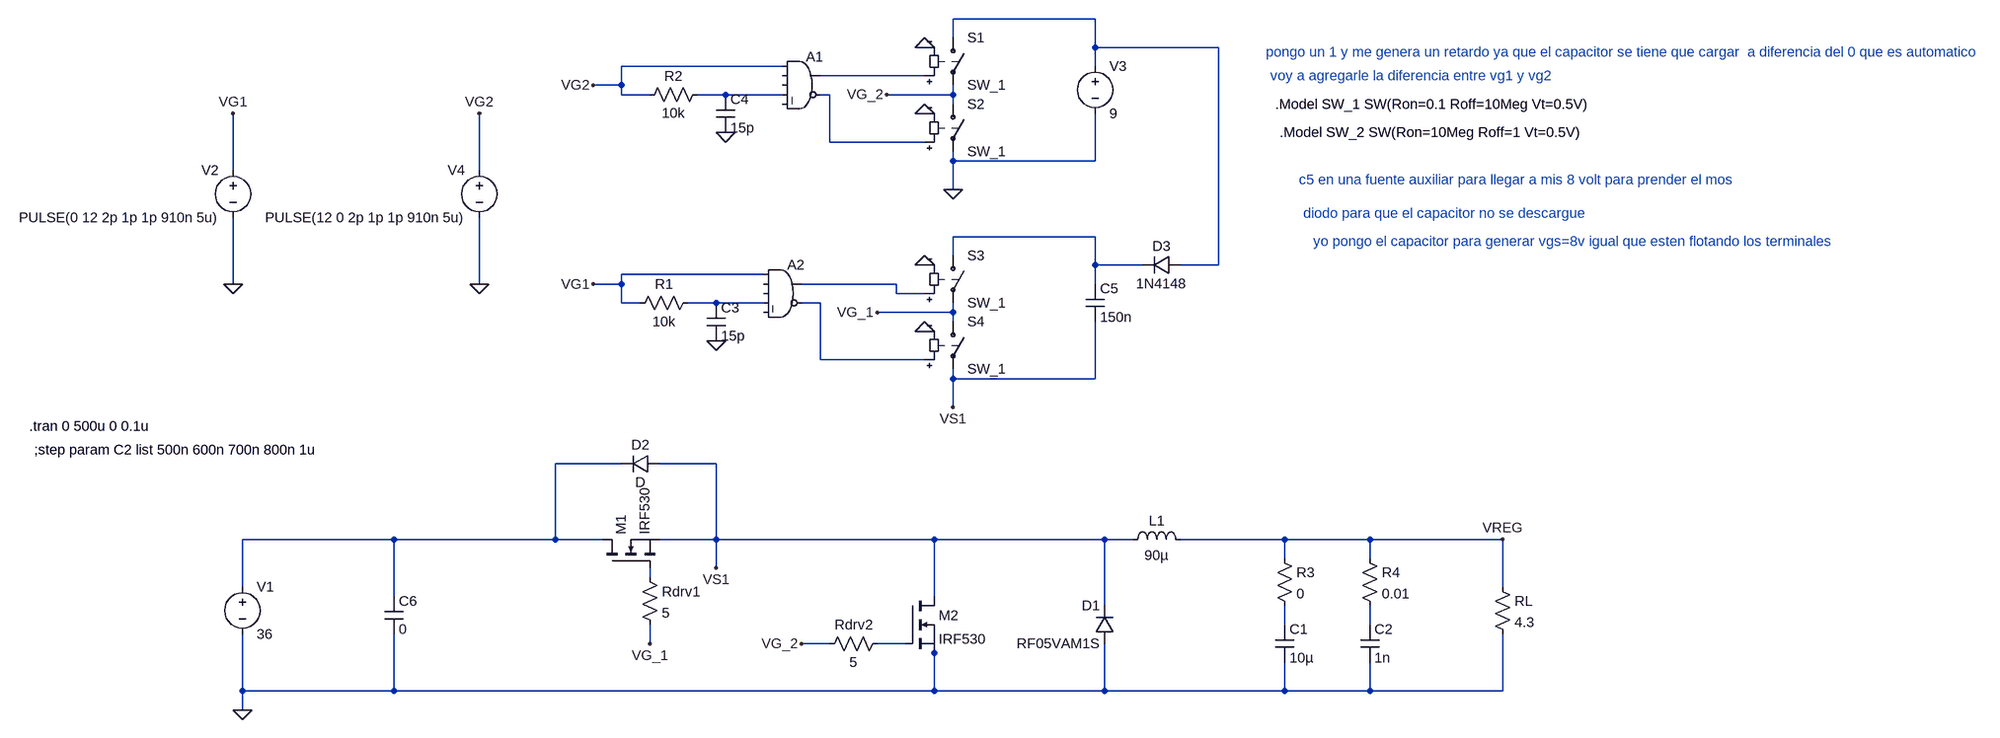
[diagram p0: schematic BUCK_v3.asc]
BUCK_v3.asc, the LTspice schematic file:
Version 4
SHEET 1 1932 728
WIRE -400 -784 -640 -784
WIRE -640 -752 -640 -784
WIRE -400 -736 -400 -784
WIRE -192 -736 -400 -736
WIRE -928 -704 -1200 -704
WIRE -400 -704 -400 -736
WIRE -688 -688 -864 -688
WIRE -1200 -672 -1200 -704
WIRE -1200 -672 -1248 -672
WIRE -1200 -656 -1200 -672
WIRE -1152 -656 -1200 -656
WIRE -1024 -656 -1072 -656
WIRE -928 -656 -1024 -656
WIRE -848 -656 -864 -656
WIRE -640 -656 -640 -672
WIRE -640 -656 -752 -656
WIRE -640 -640 -640 -656
WIRE -848 -576 -848 -656
WIRE -688 -576 -848 -576
WIRE -640 -544 -640 -560
WIRE -400 -544 -400 -624
WIRE -400 -544 -640 -544
WIRE -1856 -528 -1856 -624
WIRE -1440 -528 -1440 -624
WIRE -640 -496 -640 -544
WIRE -400 -416 -640 -416
WIRE -640 -384 -640 -416
WIRE -400 -368 -400 -416
WIRE -320 -368 -400 -368
WIRE -192 -368 -192 -736
WIRE -192 -368 -256 -368
WIRE -960 -352 -1200 -352
WIRE -1856 -336 -1856 -448
WIRE -1440 -336 -1440 -448
WIRE -1200 -336 -1200 -352
WIRE -1200 -336 -1248 -336
WIRE -736 -336 -896 -336
WIRE -400 -336 -400 -368
WIRE -736 -320 -736 -336
WIRE -688 -320 -736 -320
WIRE -1200 -304 -1200 -336
WIRE -1168 -304 -1200 -304
WIRE -1040 -304 -1088 -304
WIRE -960 -304 -1040 -304
WIRE -864 -304 -896 -304
WIRE -640 -288 -640 -304
WIRE -640 -288 -768 -288
WIRE -640 -272 -640 -288
WIRE -864 -208 -864 -304
WIRE -688 -208 -864 -208
WIRE -640 -176 -640 -192
WIRE -400 -176 -400 -272
WIRE -400 -176 -640 -176
WIRE -640 -128 -640 -176
WIRE -1200 -32 -1312 -32
WIRE -1040 -32 -1136 -32
WIRE -1584 96 -1840 96
WIRE -1312 96 -1312 -32
WIRE -1312 96 -1584 96
WIRE -1232 96 -1312 96
WIRE -1040 96 -1040 -32
WIRE -1040 96 -1136 96
WIRE -672 96 -1040 96
WIRE -384 96 -672 96
WIRE -336 96 -384 96
WIRE -80 96 -256 96
WIRE 64 96 -80 96
WIRE 288 96 64 96
WIRE -80 128 -80 96
WIRE 64 128 64 96
WIRE -1040 144 -1040 96
WIRE -1152 160 -1152 144
WIRE -1840 176 -1840 96
WIRE 288 176 288 96
WIRE -1584 192 -1584 96
WIRE -672 192 -672 96
WIRE -384 208 -384 96
WIRE -80 240 -80 208
WIRE 64 240 64 208
WIRE -1152 272 -1152 240
WIRE -848 272 -896 272
WIRE -720 272 -768 272
WIRE -672 288 -672 272
WIRE -1840 352 -1840 256
WIRE -1584 352 -1584 256
WIRE -1584 352 -1840 352
WIRE -672 352 -672 288
WIRE -672 352 -1584 352
WIRE -384 352 -384 272
WIRE -384 352 -672 352
WIRE -80 352 -80 304
WIRE -80 352 -384 352
WIRE 64 352 64 304
WIRE 64 352 -80 352
WIRE 288 352 288 256
WIRE 288 352 64 352
WIRE -1840 384 -1840 352
FLAG -1856 -336 0
FLAG -1840 384 0
FLAG -1856 -624 VG1
FLAG -1152 272 VG_1
FLAG 288 96 VREG
FLAG -1440 -624 VG2
FLAG -1440 -336 0
FLAG -896 272 VG_2
FLAG -1040 -240 0
FLAG -1024 -592 0
FLAG -1248 -336 VG1
FLAG -1248 -672 VG2
FLAG -688 -624 0
FLAG -688 -736 0
FLAG -688 -256 0
FLAG -688 -368 0
FLAG -768 -288 VG_1
FLAG -752 -656 VG_2
FLAG -640 -496 0
FLAG -1040 144 VS1
FLAG -640 -128 VS1
SYMBOL voltage -1840 160 R0
WINDOW 123 0 0 Left 0
WINDOW 39 0 0 Left 0
SYMATTR InstName V1
SYMATTR Value 36
SYMBOL ind -352 112 R270
WINDOW 0 32 56 VTop 2
WINDOW 3 5 56 VBottom 2
SYMATTR InstName L1
SYMATTR Value 90µ
SYMBOL cap -96 240 R0
SYMATTR InstName C1
SYMATTR Value 10µ
SYMBOL nmos -1232 144 R270
SYMATTR InstName M1
SYMATTR Value IRF530
SYMBOL voltage -1856 -544 M0
WINDOW 123 0 0 Left 0
WINDOW 39 0 0 Left 0
SYMATTR InstName V2
SYMATTR Value PULSE(0 12 2p 1p 1p 910n 5u)
SYMBOL voltage -1440 -544 M0
WINDOW 123 0 0 Left 0
WINDOW 39 0 0 Left 0
SYMATTR InstName V4
SYMATTR Value PULSE(12 0 2p 1p 1p 910n 5u)
SYMBOL nmos -720 192 R0
SYMATTR InstName M2
SYMATTR Value IRF530
SYMBOL cap 48 240 R0
SYMATTR InstName C2
SYMATTR Value 1n
SYMBOL res 272 160 R0
SYMATTR InstName RL
SYMATTR Value 4.3
SYMBOL diode -368 272 R180
WINDOW 0 24 64 Left 2
WINDOW 3 24 0 Left 2
SYMATTR InstName D1
SYMATTR Value RF05VAM1S
SYMBOL diode -1136 -48 R90
WINDOW 0 0 32 VBottom 2
WINDOW 3 32 32 VTop 2
SYMATTR InstName D2
SYMBOL Digital\\and -928 -384 R0
SYMATTR InstName A2
SYMBOL cap -1056 -304 R0
SYMATTR InstName C3
SYMATTR Value 15p
SYMBOL res -1072 -320 R90
WINDOW 0 0 56 VBottom 2
WINDOW 3 32 56 VTop 2
SYMATTR InstName R1
SYMATTR Value 10k
SYMBOL Digital\\and -896 -736 R0
SYMATTR InstName A1
SYMBOL cap -1040 -656 R0
SYMATTR InstName C4
SYMATTR Value 15p
SYMBOL res -1056 -672 R90
WINDOW 0 0 56 VBottom 2
WINDOW 3 32 56 VTop 2
SYMATTR InstName R2
SYMATTR Value 10k
SYMBOL sw -640 -768 R0
SYMATTR InstName S1
SYMATTR Value SW_1
SYMBOL sw -640 -656 R0
SYMATTR InstName S2
SYMATTR Value SW_1
SYMBOL voltage -400 -720 R0
WINDOW 123 0 0 Left 0
WINDOW 39 0 0 Left 0
SYMATTR InstName V3
SYMATTR Value 9
SYMBOL sw -640 -400 R0
SYMATTR InstName S3
SYMATTR Value SW_1
SYMBOL sw -640 -288 R0
SYMATTR InstName S4
SYMATTR Value SW_1
SYMBOL cap -416 -336 R0
SYMATTR InstName C5
SYMATTR Value 150n
SYMBOL diode -256 -384 R90
WINDOW 0 0 32 VBottom 2
WINDOW 3 32 32 VTop 2
SYMATTR InstName D3
SYMATTR Value 1N4148
SYMBOL res -96 112 R0
SYMATTR InstName R3
SYMATTR Value 0
SYMBOL res 48 112 R0
SYMATTR InstName R4
SYMATTR Value 0.01
SYMBOL cap -1600 192 R0
SYMATTR InstName C6
SYMATTR Value 0
SYMBOL res -752 256 R90
WINDOW 0 0 56 VBottom 2
WINDOW 3 32 56 VTop 2
SYMATTR InstName Rdrv2
SYMATTR Value 5
SYMBOL res -1168 144 R0
SYMATTR InstName Rdrv1
SYMATTR Value 5
TEXT -2200 -96 Left 2 !.tran 0 500u 0 0.1u
TEXT -2192 -56 Left 2 !;step param C2 list 500n 600n 700n 800n 1u
TEXT -112 -728 Left 2 ;pongo un 1 y me genera un retardo ya que el capacitor se tiene que cargar  a diferencia del 0 que es automatico
TEXT -104 -688 Left 2 ;voy a agregarle la diferencia entre vg1 y vg2
TEXT -96 -640 Left 2 !.Model SW_1 SW(Ron=0.1 Roff=10Meg Vt=0.5V)
TEXT -88 -592 Left 2 !.Model SW_2 SW(Ron=10Meg Roff=1 Vt=0.5V)
TEXT -56 -512 Left 2 ;c5 en una fuente auxiliar para llegar a mis 8 volt para prender el mos
TEXT -48 -456 Left 2 ;diodo para que el capacitor no se descargue
TEXT -32 -408 Left 2 ;yo pongo el capacitor para generar vgs=8v igual que esten flotando los terminales

The netlist it stands for:
* BUCK_v3.asc
V1 N009 0 36
L1 VS1 VREG 90µ
C1 N011 0 10µ
M1 N009 N010 VS1 VS1 IRF530
V2 VG1 0 PULSE(0 12 2p 1p 1p 910n 5u)
V4 VG2 0 PULSE(12 0 2p 1p 1p 910n 5u)
M2 VS1 N013 0 0 IRF530
C2 N012 0 1n
RL VREG 0 4.3
D1 0 VS1 RF05VAM1S
D2 VS1 N009 D
A2 VG1 0 0 N007 0 N008 N006 0 AND
C3 N007 0 15p
R1 N007 VG1 10k
A1 VG2 0 0 N003 0 N004 N002 0 AND
C4 N003 0 15p
R2 N003 VG2 10k
S1 N001 VG_2 N002 0 SW_1
S2 VG_2 0 N004 0 SW_1
V3 N001 0 9
S3 N005 VG_1 N006 0 SW_1
S4 VG_1 VS1 N008 0 SW_1
C5 N005 VS1 150n
D3 N001 N005 1N4148
R3 VREG N011 0
R4 VREG N012 0.01
C6 N009 0 0
Rdrv2 N013 VG_2 5
Rdrv1 N010 VG_1 5
.model D D
.lib standard.dio
.model NMOS NMOS
.model PMOS PMOS
.lib standard.mos
.tran 0 500u 0 0.1u
;step param C2 list 500n 600n 700n 800n 1u
* pongo un 1 y me genera un retardo ya que el capacitor se tiene que cargar  a diferencia del 0 que es automatico
* voy a agregarle la diferencia entre vg1 y vg2
.Model SW_1 SW(Ron=0.1 Roff=10Meg Vt=0.5V)
.Model SW_2 SW(Ron=10Meg Roff=1 Vt=0.5V)
* c5 en una fuente auxiliar para llegar a mis 8 volt para prender el mos
* diodo para que el capacitor no se descargue
* yo pongo el capacitor para generar vgs=8v igual que esten flotando los terminales
.backanno
.end